# Altium schematic sheet RCJ_OnStage2024_FC_pwr.SchDoc
size 594 x 420 mm; SheetNumber: 4; SheetTotal: 4; SheetSize: А3
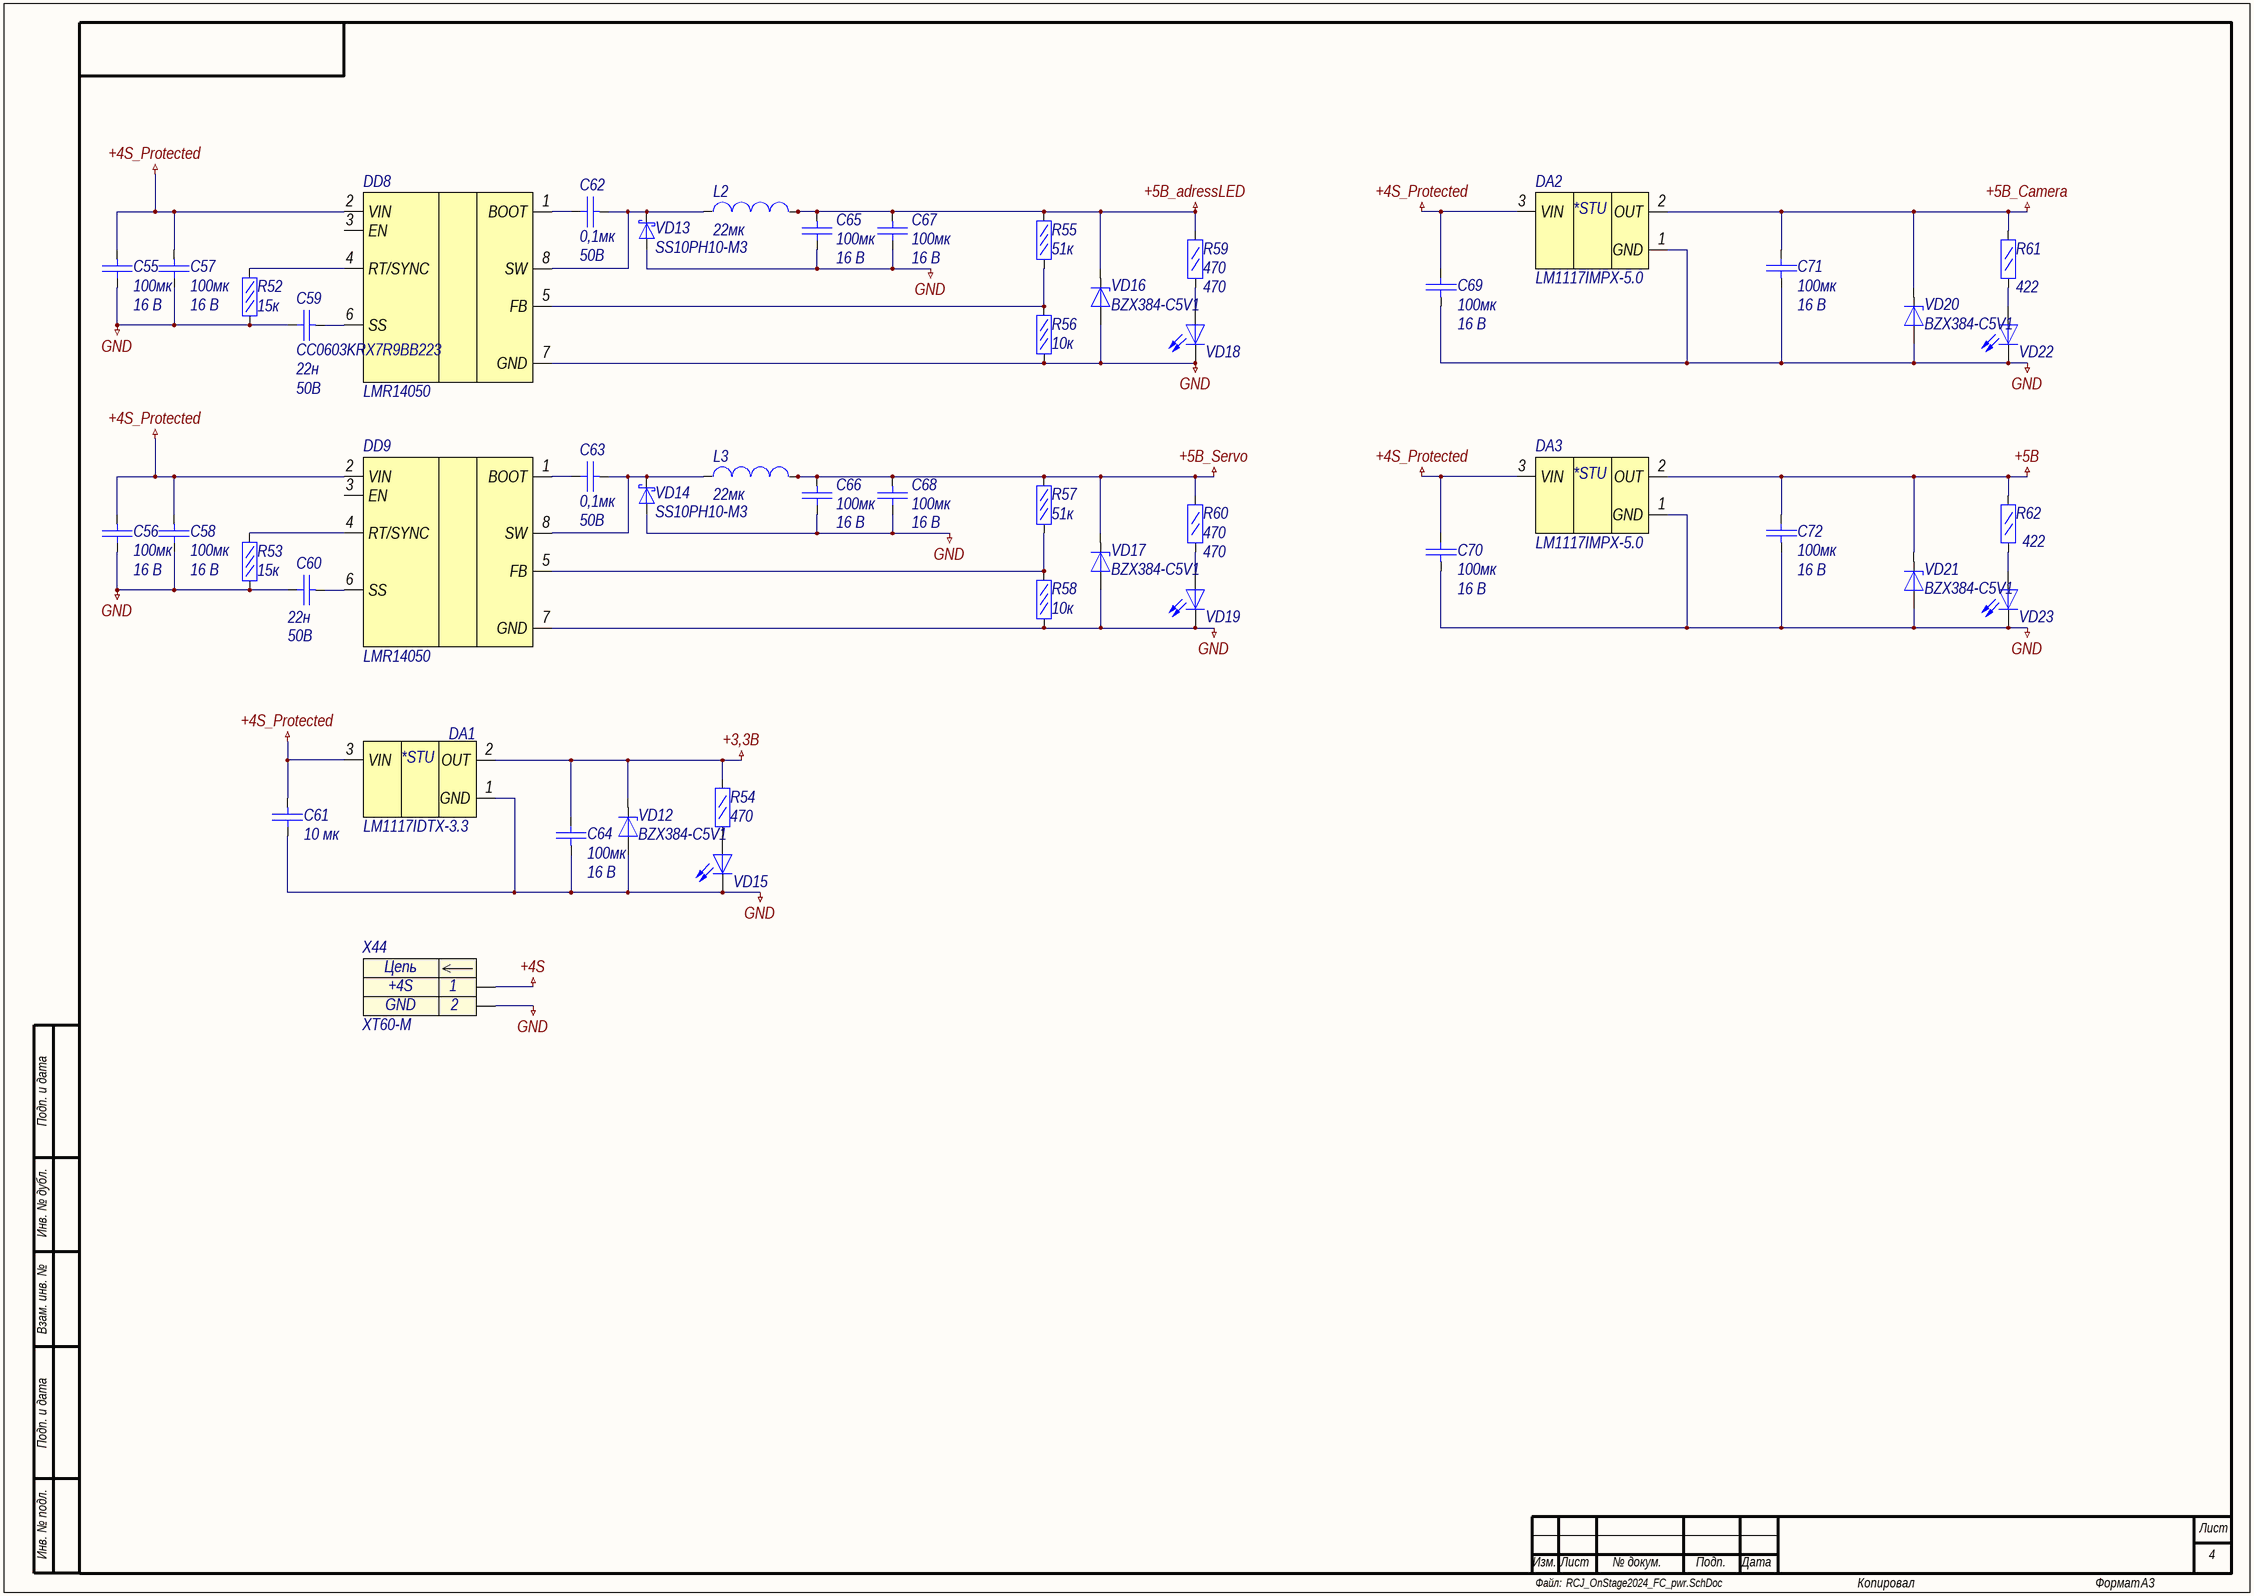
[diagram p0: RCJ_OnStage2024_FC_pwr.SchDoc]

## Parts
C55  100мк  Voltage: 16 В  [C1210]
C56  100мк  Voltage: 16 В  [C1210]
C57  100мк  Voltage: 16 В  [C1210]
C58  100мк  Voltage: 16 В  [C1210]
C59  CC0603KRX7R9BB223  value 22н  Voltage: 50В  [C0603]
C60  value 22н  Voltage: 50В  [C0603]  (hidden comment: CC0603KRX7R9BB223)
C61  10 мк  [C0805]
C62  0,1мк  Voltage: 50В  [C0603]
C63  0,1мк  Voltage: 50В  [C0603]
C64  100мк  Voltage: 16 В  [C1210]
C65  100мк  Voltage: 16 В  [C1210]
C66  100мк  Voltage: 16 В  [C1210]
C67  100мк  Voltage: 16 В  [C1210]
C68  100мк  Voltage: 16 В  [C1210]
C69  100мк  Voltage: 16 В  [C1210]
C70  100мк  Voltage: 16 В  [C1210]
C71  100мк  Voltage: 16 В  [C1210]
C72  100мк  Voltage: 16 В  [C1210]
DA1  LM1117IDTX-3.3  [D-PAK]
DA2  LM1117IMPX-5.0  [SOT-223]
DA3  LM1117IMPX-5.0  [SOT-223]
DD8  LMR14050  [SO-8]
DD9  LMR14050  [SO-8]
L2  value 22мк  [SRP1038A]  (hidden comment: SRP1038A-220M)
L3  value 22мк  [SRP1038A]  (hidden comment: SRP1038A-220M)
R52  15к  [R0603]
R53  15к  [R0603]
R54  470  [R0805]
R55  51к  [R0603]
R56  10к  [R0603]
R57  51к  [R0603]
R58  10к  [R0603]
R59  470  [R0805]
R60  470  [R0805]
R61  422  [R0805]
R62  422  [R0805]
VD12  BZX384-C5V1  [SOD323]
VD13  SS10PH10-M3  [TO277A]
VD14  SS10PH10-M3  [TO277A]
VD15  (no value)  [LED0603_RED]
VD16  BZX384-C5V1  [SOD323]
VD17  BZX384-C5V1  [SOD323]
VD18  (no value)  [LED0603_RED]
VD19  (no value)  [LED0603_RED]
VD20  BZX384-C5V1  [SOD323]
VD21  BZX384-C5V1  [SOD323]
VD22  (no value)  [LED0603_RED]
VD23  (no value)  [LED0603_RED]
X44  XT60-M  [XT60-M]

## Nets
+3,3В: C64.1 DA1.2(OUT) R54.2 VD12.2(K)
+4S: X44.1
+4S_Protected: C55.2 C56.2 C57.2 C58.2 C61.2 C69.1 C70.1 DA1.3(VIN) DA2.3(VIN) DA3.3(VIN) DD8.2(VIN) DD9.2(VIN)
+5В: C72.1 DA3.2(OUT) R62.2 VD21.2(K)
+5В_adressLED: C65.2 C67.2 L2.2 R55.2 R59.2 VD16.2(K)
+5В_Camera: C71.1 DA2.2(OUT) R61.2 VD20.2(K)
+5В_Servo: C66.2 C68.2 L3.2 R57.2 R60.2 VD17.2(K)
GND: C55.1 C56.1 C57.1 C58.1 C59.1 C60.1 C61.1 C64.2 C65.1 C66.1 C67.1 C68.1 C69.2 C70.2 C71.2 C72.2 DA1.1(GND) DA2.1(GND) DA3.1(GND) DD8.7(GND) DD9.7(GND) R52.1 R53.1 R56.1 R58.1 VD12.1(A) VD13.2(A) VD14.2(A) VD15.1(K) VD16.1(A) VD17.1(A) VD18.1(K) VD19.1(K) VD20.1(A) VD21.1(A) VD22.1(K) VD23.1(K) X44.2
NetC59_2: C59.2 DD8.6(SS)
NetC60_2: C60.2 DD9.6(SS)
NetC62_1: C62.1 DD8.1(BOOT)
NetC62_2: C62.2 DD8.8(SW) L2.1 VD13.1(K)
NetC63_1: C63.1 DD9.1(BOOT)
NetC63_2: C63.2 DD9.8(SW) L3.1 VD14.1(K)
NetDD8_4: DD8.4(RT/SYNC) R52.2
NetDD8_5: DD8.5(FB) R55.1 R56.2
NetDD9_4: DD9.4(RT/SYNC) R53.2
NetDD9_5: DD9.5(FB) R57.1 R58.2
NetR54_1: R54.1 VD15.2(A)
NetR59_1: R59.1 VD18.2(A)
NetR60_1: R60.1 VD19.2(A)
NetR61_1: R61.1 VD22.2(A)
NetR62_1: R62.1 VD23.2(A)

Not connected (* = marked no-connect by the designer): DD8 3(EN); DD9 3(EN)

## Notes on the sheet
- Подп. и дата
- Инв. № дубл.
- Взам. инв. №
- Инв. № подл.
- Лист
- Файл:
- Изм.
- № докум.
- Подп.
- Дата
- Копировал
- Формат
- (in symbol LM1117IDTX-3.3) *STU
- (in symbol LM1117IMPX-5.0) *STU
- (in symbol XT60-M) Цепь

## Library data of the parts
C55-C58 C64-C72 = CC1210MKX5R7BB107: Конденсатор керамический 100мкФ 16В; Value: 100мк
C59 C60 = CC0603KRX7R9BB223: Конденсатор керамический 22нФ 50В; Name: CC0603KRX7R9BB223
C61 = CC0805KKX5R8BB106: Конденсатор кер. 10мкФ 25В; Value: 10 мк
C62 C63 = GRM188R71H104KA93D: Конденсатор кер. 0,1мкФ 50В X7R; Manufacturer: Murata; Name: GRM188R71H104KA93D; TKE: X7R; Value: 0,1мк
DA1 = LM1117IDTX-3.3: Линейный стабилизатор напряжения 3,3В; Manufacturer: Texas Instruments; Name: LM1117IDTX-3.3
DA2 DA3 = LM1117IMPX-5.0: Линейный стабилизатор напряжения 5В; Name: LM1117IMPX-5.0
DD8 DD9 = LMR14050: Стабилизатор напряжения 40 В 5 А; Name: LMR14050
L2 L3 = SRP1038A-220M: Катушка индуктивности 22мкГн 5А; Name: SRP1038A-220M
R52 R53 = RC0603FR-0715KL: Резистор 15кОм 0,063Вт 1%; Manufacturer: YAGEO; Name: RC0603FR-0715KL; Tolerance: 1%; Value: 15к
R54 R59 R60 = RC0805FR-07470RL: Резистор 470 0,125Вт 1%; Manufacturer: YAGEO; Name: RC0805FR-07470RL; Tolerance: 1%; Value: 470
R55 R57 = RC1206FR-0751KL: Резистор 51кОм 0.25Вт 5%; Value: 51к
R56 R58 = RC0603FR-0710KL: Резистор 10кОм 0,063Вт 1%; Manufacturer: YAGEO; Name: RC0603FR-0710KL; Tolerance: 1%; Value: 10к
R61 R62 = RC0805FR-07422RL: Резистор 422 0,125Вт 1%; Manufacturer: YAGEO; Name: RC0805FR-07422RL; Tolerance: 1%; Value: 422
VD12 VD16 VD17 VD20 VD21 = BZX384-C5V1: Стабилитрон 5,1В; Name: BZX384-C5V1
VD13 VD14 = SS10PH10-M3/86A: Диод Шоттки 86 А; Name: SS10PH10-M3
VD15 VD18 VD19 VD22 VD23 = LED: Светодиод
X44 = XT60-M: Разъем питания 2pin штекер; Contact_1: +4S; Contact_2: GND; Name: XT60-M